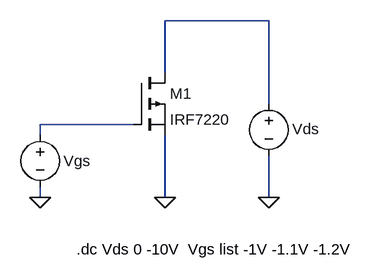
[diagram p0: schematic MOS-OUT-3.asc]
MOS-OUT-3.asc, the LTspice schematic file:
Version 4
SHEET 1 1292 680
WIRE -560 -144 -720 -144
WIRE -720 -64 -720 -144
WIRE -560 -16 -560 -144
WIRE -768 16 -912 16
WIRE -912 32 -912 16
WIRE -912 128 -912 112
WIRE -720 128 -720 32
WIRE -560 128 -560 64
FLAG -560 128 0
FLAG -912 128 0
FLAG -720 128 0
SYMBOL voltage -560 -32 R0
WINDOW 123 0 0 Left 2
WINDOW 39 37 60 Left 2
WINDOW 0 36 55 Left 2
WINDOW 3 37 60 Left 2
SYMATTR InstName Vds
SYMATTR Value ""
SYMBOL voltage -912 16 R0
WINDOW 123 0 0 Left 2
WINDOW 39 40 53 Left 2
WINDOW 3 40 69 Left 2
WINDOW 0 36 56 Left 2
SYMATTR Value ""
SYMATTR InstName Vgs
SYMBOL pmos -768 -64 R0
SYMATTR InstName M1
SYMATTR Value IRF7220
TEXT -856 208 Left 2 !.dc Vds 0 -10V  Vgs list -1V -1.1V -1.2V

The netlist it stands for:
* MOS-OUT-3.asc
Vds N001 0
Vgs N002 0
M1 N001 N002 0 0 IRF7220
.model NMOS NMOS
.model PMOS PMOS
.lib standard.mos
.dc Vds 0 -10V  Vgs list -1V -1.1V -1.2V
.backanno
.end